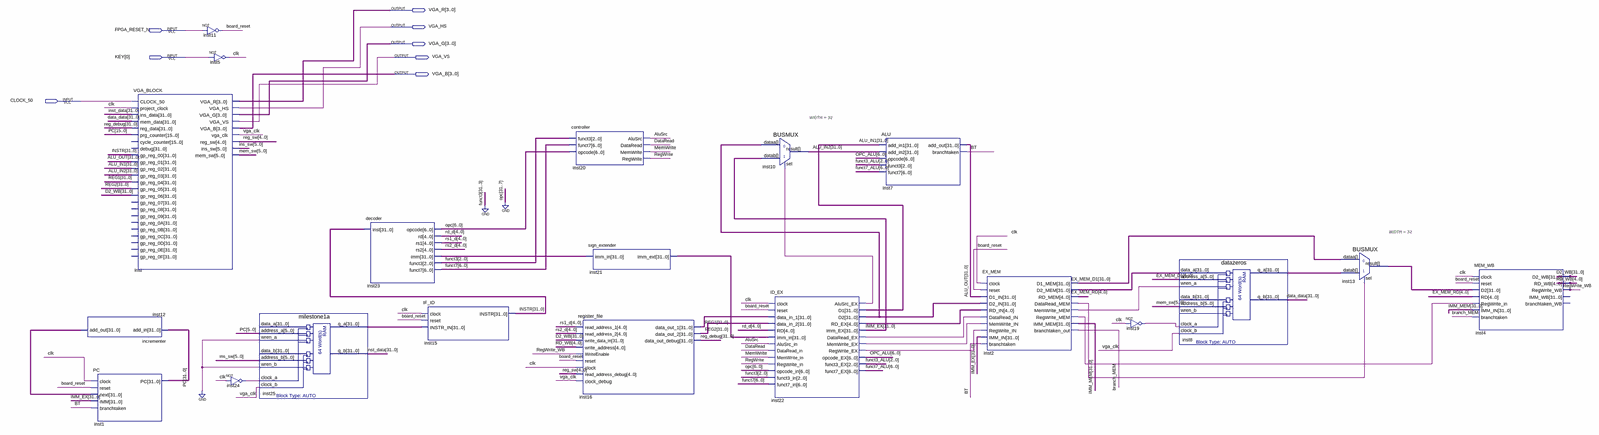
[diagram p0: schematic sheet, whole]
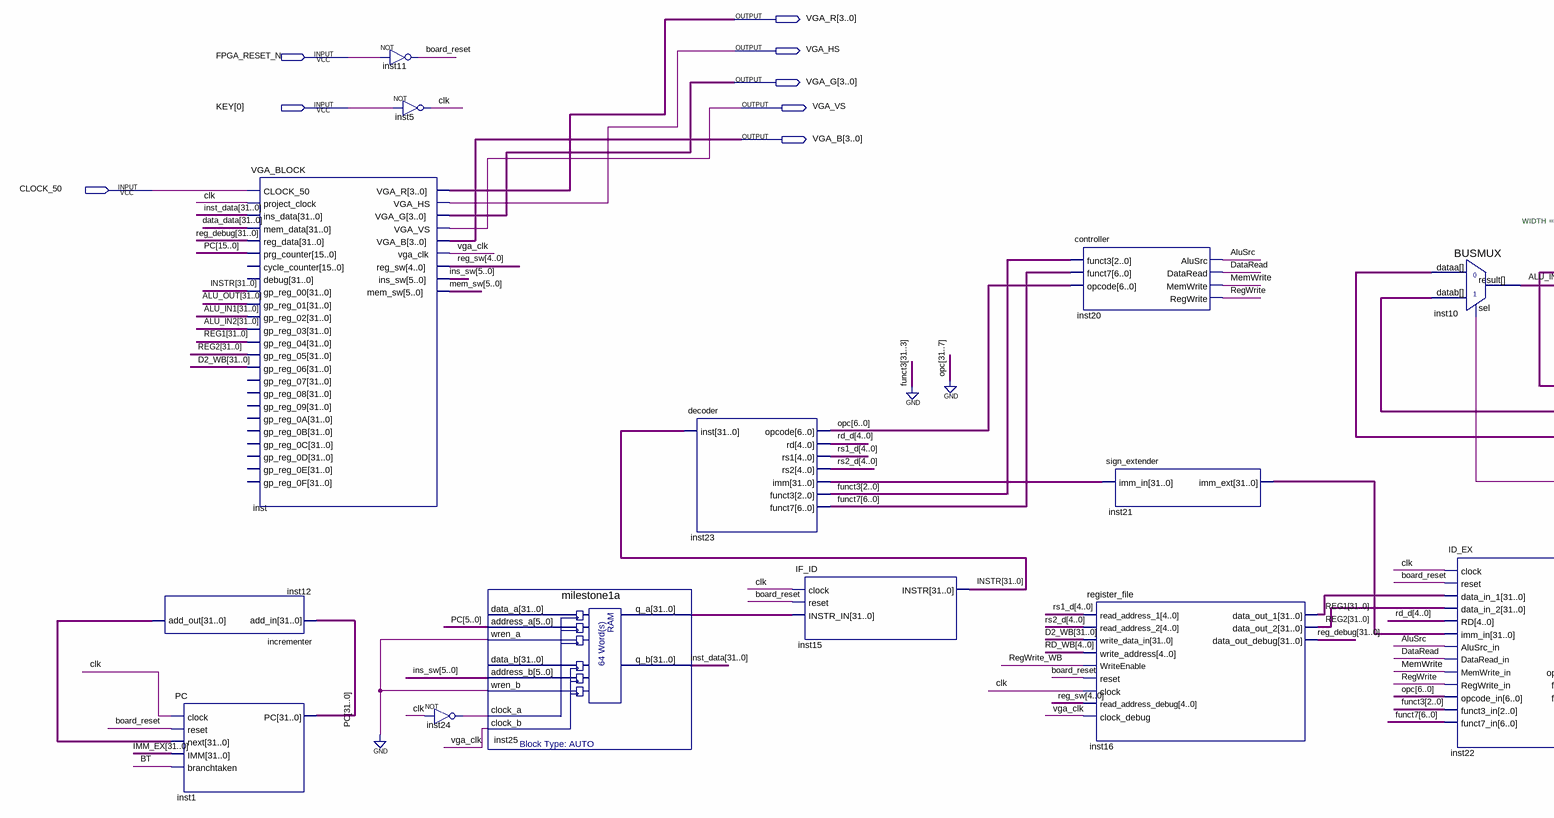
[diagram p1: schematic sheet, left part]
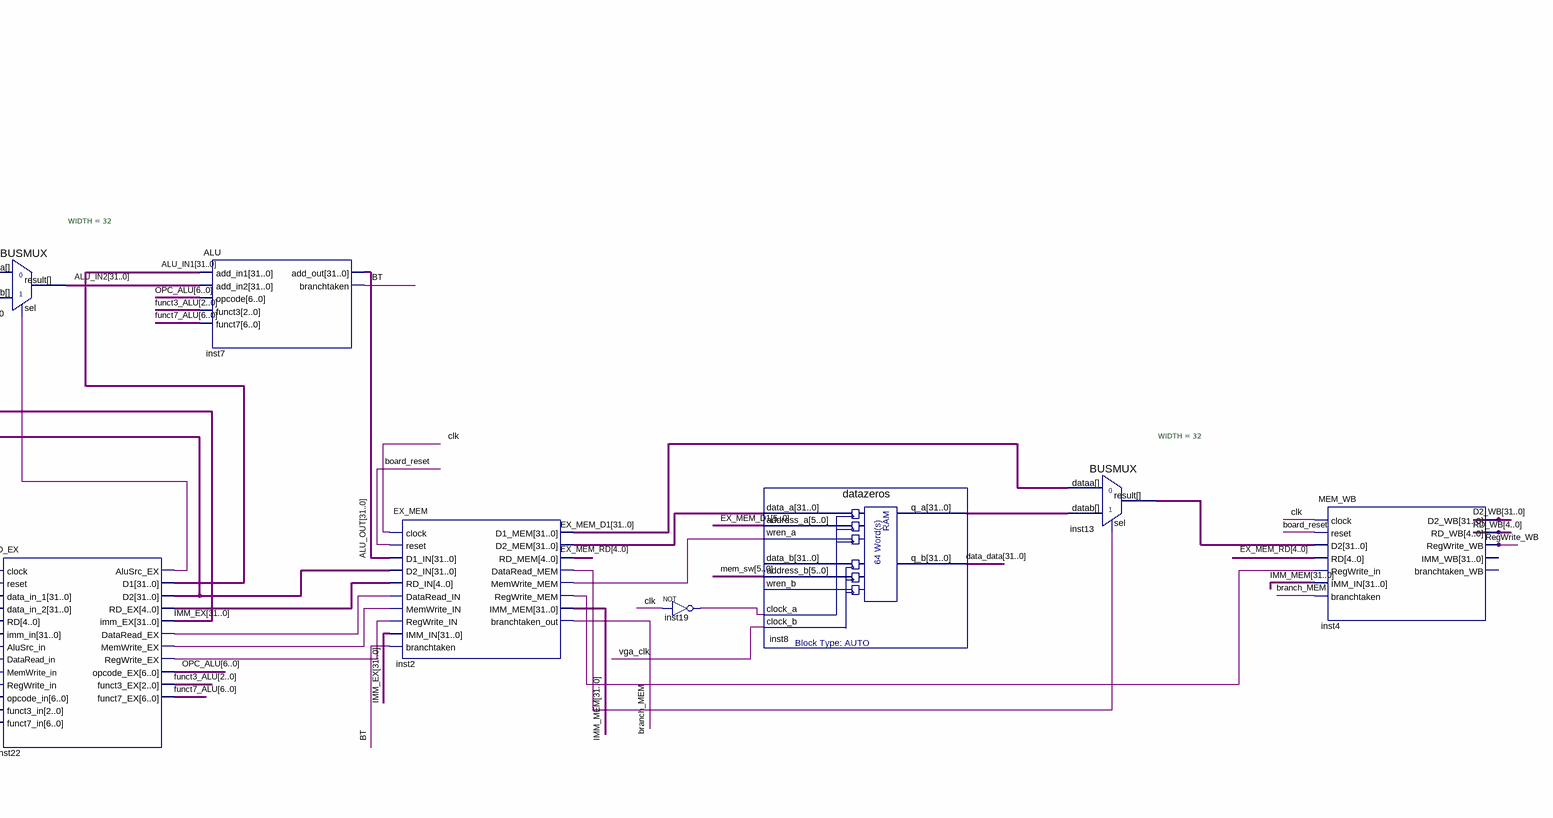
[diagram p2: schematic sheet, right part]
// Quartus schematic top.bdf as structural Verilog: 20 symbols, 8 pins
module top (
  input  FPGA_RESET_N,
  input  [0:0] KEY,
  input  CLOCK_50,
  output [3:0] VGA_R,
  output VGA_HS,
  output [3:0] VGA_G,
  output VGA_VS,
  output [3:0] VGA_B
);

  wire AluSrc, board_reset, branch_MEM, BT, clk, DataRead, inst2_dataread_mem, inst2_memwrite_mem,
       inst2_regwrite_mem, inst19_out, inst22_alusrc_ex, inst22_dataread_ex, inst22_memwrite_ex,
       inst22_regwrite_ex, inst24_out, MemWrite, RegWrite, RegWrite_WB, vga_clk;
  wire [2:0] funct3, funct3_ALU;
  wire [4:0] EX_MEM_RD, inst22_rd_ex, rd_d, RD_WB, reg_sw, rs1_d, rs2_d;
  wire [5:0] ins_sw, mem_sw;
  wire [6:0] funct7, funct7_ALU, opc, OPC_ALU;
  wire [31:0] ALU_IN1, ALU_IN2, ALU_OUT, D2_WB, data_data, EX_MEM_D1, IMM_EX, IMM_MEM, inst2_d2_mem,
       inst8_q_a, inst12_add_out, inst13_result, inst21_imm_ext, inst22_d2, inst23_imm, inst25_q_a,
       inst_data, INSTR, PC, REG1, REG2, reg_debug;

  incrementer inst12 (.add_in(PC), .add_out(inst12_add_out));
  PC inst1 (.clock(clk), .reset(board_reset), .next(inst12_add_out), .IMM(IMM_EX), .branchtaken(BT), .PC(PC));
  VGA_BLOCK inst (
    .CLOCK_50(CLOCK_50), .project_clock(clk), .ins_data(inst_data), .mem_data(data_data),
    .reg_data(reg_debug), .prg_counter(PC[15:0]), .gp_reg_00(INSTR), .gp_reg_01(ALU_OUT),
    .gp_reg_02(ALU_IN1), .gp_reg_03(ALU_IN2), .gp_reg_04(REG1), .gp_reg_05(REG2), .gp_reg_06(D2_WB),
    .VGA_R(VGA_R), .VGA_HS(VGA_HS), .VGA_G(VGA_G), .VGA_VS(VGA_VS), .VGA_B(VGA_B), .vga_clk(vga_clk),
    .reg_sw(reg_sw), .ins_sw(ins_sw), .mem_sw(mem_sw));  // open: cycle_counter, debug, gp_reg_07, gp_reg_08, gp_reg_09, gp_reg_0A, gp_reg_0B, gp_reg_0C, gp_reg_0D, gp_reg_0E, gp_reg_0F
  not inst11 (board_reset, FPGA_RESET_N);
  not inst5 (clk, KEY[0]);
  not inst24 (inst24_out, clk);
  milestone1a inst25 (
    .address_a(PC[5:0]), .wren_a(1'b0), .address_b(ins_sw), .wren_b(1'b0), .clock_a(inst24_out),
    .clock_b(vga_clk), .q_a(inst25_q_a), .q_b(inst_data));  // open: data_a, data_b
  decoder inst23 (
    .inst(INSTR), .opcode(opc), .rd(rd_d), .rs1(rs1_d), .rs2(rs2_d), .imm(inst23_imm), .funct3(funct3),
    .funct7(funct7));
  IF_ID inst15 (.clock(clk), .reset(board_reset), .INSTR_IN(inst25_q_a), .INSTR(INSTR));
  controller inst20 (
    .funct3(funct3), .funct7(funct7), .opcode(opc), .AluSrc(AluSrc), .DataRead(DataRead),
    .MemWrite(MemWrite), .RegWrite(RegWrite));
  register_file inst16 (
    .read_address_1(rs1_d), .read_address_2(rs2_d), .write_data_in(D2_WB), .write_address(RD_WB),
    .WriteEnable(RegWrite_WB), .reset(board_reset), .clock(clk), .read_address_debug(reg_sw),
    .clock_debug(vga_clk), .data_out_1(REG1), .data_out_2(REG2), .data_out_debug(reg_debug));
  sign_extender inst21 (.imm_in(inst23_imm), .imm_ext(inst21_imm_ext));
  BUSMUX #(.WIDTH(32)) inst10 (.datab(IMM_EX), .sel(inst22_alusrc_ex), .dataa(inst22_d2), .result(ALU_IN2));
  ID_EX inst22 (
    .clock(clk), .reset(board_reset), .data_in_1(REG1), .data_in_2(REG2), .RD(rd_d), .imm_in(inst21_imm_ext),
    .AluSrc_in(AluSrc), .DataRead_in(DataRead), .MemWrite_in(MemWrite), .RegWrite_in(RegWrite),
    .opcode_in(opc), .funct3_in(funct3), .funct7_in(funct7), .AluSrc_EX(inst22_alusrc_ex), .D1(ALU_IN1),
    .D2(inst22_d2), .RD_EX(inst22_rd_ex), .imm_EX(IMM_EX), .DataRead_EX(inst22_dataread_ex),
    .MemWrite_EX(inst22_memwrite_ex), .RegWrite_EX(inst22_regwrite_ex), .opcode_EX(OPC_ALU),
    .funct3_EX(funct3_ALU), .funct7_EX(funct7_ALU));
  ALU inst7 (
    .add_in1(ALU_IN1), .add_in2(ALU_IN2), .opcode(OPC_ALU), .funct3(funct3_ALU), .funct7(funct7_ALU),
    .add_out(ALU_OUT), .branchtaken(BT));
  EX_MEM inst2 (
    .clock(clk), .reset(board_reset), .D1_IN(ALU_OUT), .D2_IN(inst22_d2), .RD_IN(inst22_rd_ex),
    .DataRead_IN(inst22_dataread_ex), .MemWrite_IN(inst22_memwrite_ex), .RegWrite_IN(inst22_regwrite_ex),
    .IMM_IN(IMM_EX), .branchtaken(BT), .D1_MEM(EX_MEM_D1), .D2_MEM(inst2_d2_mem), .RD_MEM(EX_MEM_RD),
    .DataRead_MEM(inst2_dataread_mem), .MemWrite_MEM(inst2_memwrite_mem), .RegWrite_MEM(inst2_regwrite_mem),
    .IMM_MEM(IMM_MEM), .branchtaken_out(branch_MEM));
  not inst19 (inst19_out, clk);
  datazeros inst8 (
    .data_a(inst2_d2_mem), .address_a(EX_MEM_D1[5:0]), .wren_a(inst2_memwrite_mem), .address_b(mem_sw),
    .clock_a(inst19_out), .clock_b(vga_clk), .q_a(inst8_q_a), .q_b(data_data));  // open: data_b, wren_b
  BUSMUX #(.WIDTH(32)) inst13 (.datab(inst8_q_a), .sel(inst2_dataread_mem), .dataa(EX_MEM_D1), .result(inst13_result));
  MEM_WB inst4 (
    .clock(clk), .reset(board_reset), .D2(inst13_result), .RD(EX_MEM_RD), .RegWrite_in(inst2_regwrite_mem),
    .IMM_IN(IMM_MEM), .branchtaken(branch_MEM), .D2_WB(D2_WB), .RD_WB(RD_WB), .RegWrite_WB(RegWrite_WB));  // open: IMM_WB, branchtaken_WB
endmodule
